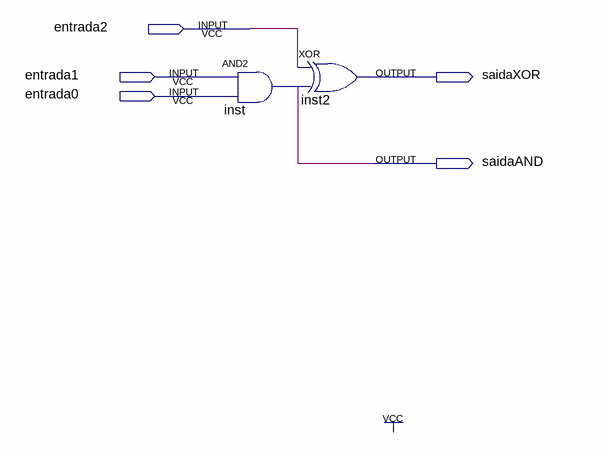
[diagram p0: schematic sheet]
// Quartus schematic andxor.bdf as structural Verilog: 2 symbols, 5 pins
module andxor (
  input  entrada2,
  input  entrada1,
  input  entrada0,
  output saidaXOR,
  output saidaAND
);

  and inst (saidaAND, entrada1, entrada0);
  xor inst2 (saidaXOR, entrada2, saidaAND);
endmodule
